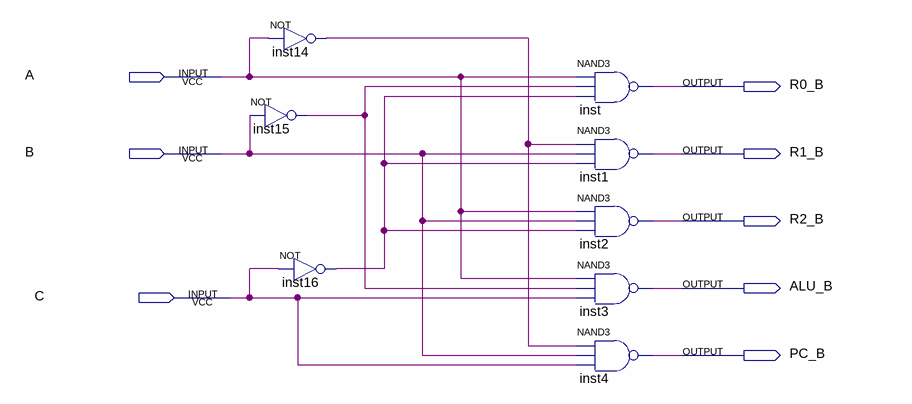
[diagram p0: schematic sheet]
// Quartus schematic decodeb.bdf as structural Verilog: 8 symbols, 8 pins
module decodeb (
  input  A,
  input  B,
  input  C,
  output R0_B,
  output R1_B,
  output R2_B,
  output ALU_B,
  output PC_B
);

  wire inst14_out, inst15_out, inst16_out;

  not inst14 (inst14_out, A);
  not inst15 (inst15_out, B);
  not inst16 (inst16_out, C);
  nand inst (R0_B, A, inst15_out, inst16_out);
  nand inst1 (R1_B, inst14_out, B, inst16_out);
  nand inst2 (R2_B, A, B, inst16_out);
  nand inst3 (ALU_B, A, inst15_out, C);
  nand inst4 (PC_B, inst14_out, B, C);
endmodule
